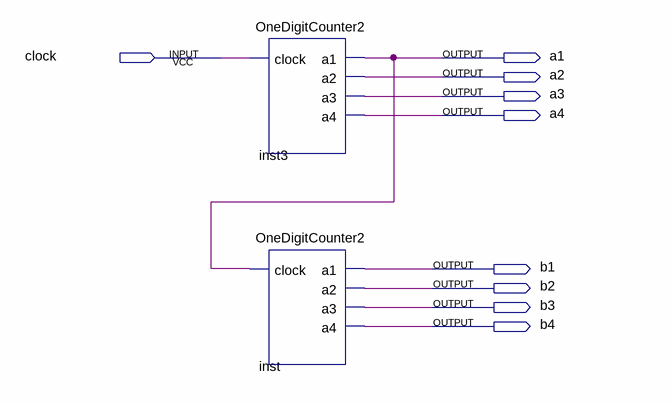
[diagram p0: schematic sheet]
// Quartus schematic fullCounter.bdf as structural Verilog: 2 symbols, 9 pins
module fullCounter (
  input  clock,
  output a1,
  output a2,
  output a3,
  output a4,
  output b1,
  output b2,
  output b3,
  output b4
);

  OneDigitCounter2 inst3 (.clock(clock), .a1(a1), .a2(a2), .a3(a3), .a4(a4));
  OneDigitCounter2 inst (.clock(a1), .a1(b1), .a2(b2), .a3(b3), .a4(b4));
endmodule
